# EAGLE design Candle-V01-005 (EAGLE 9.5.0)
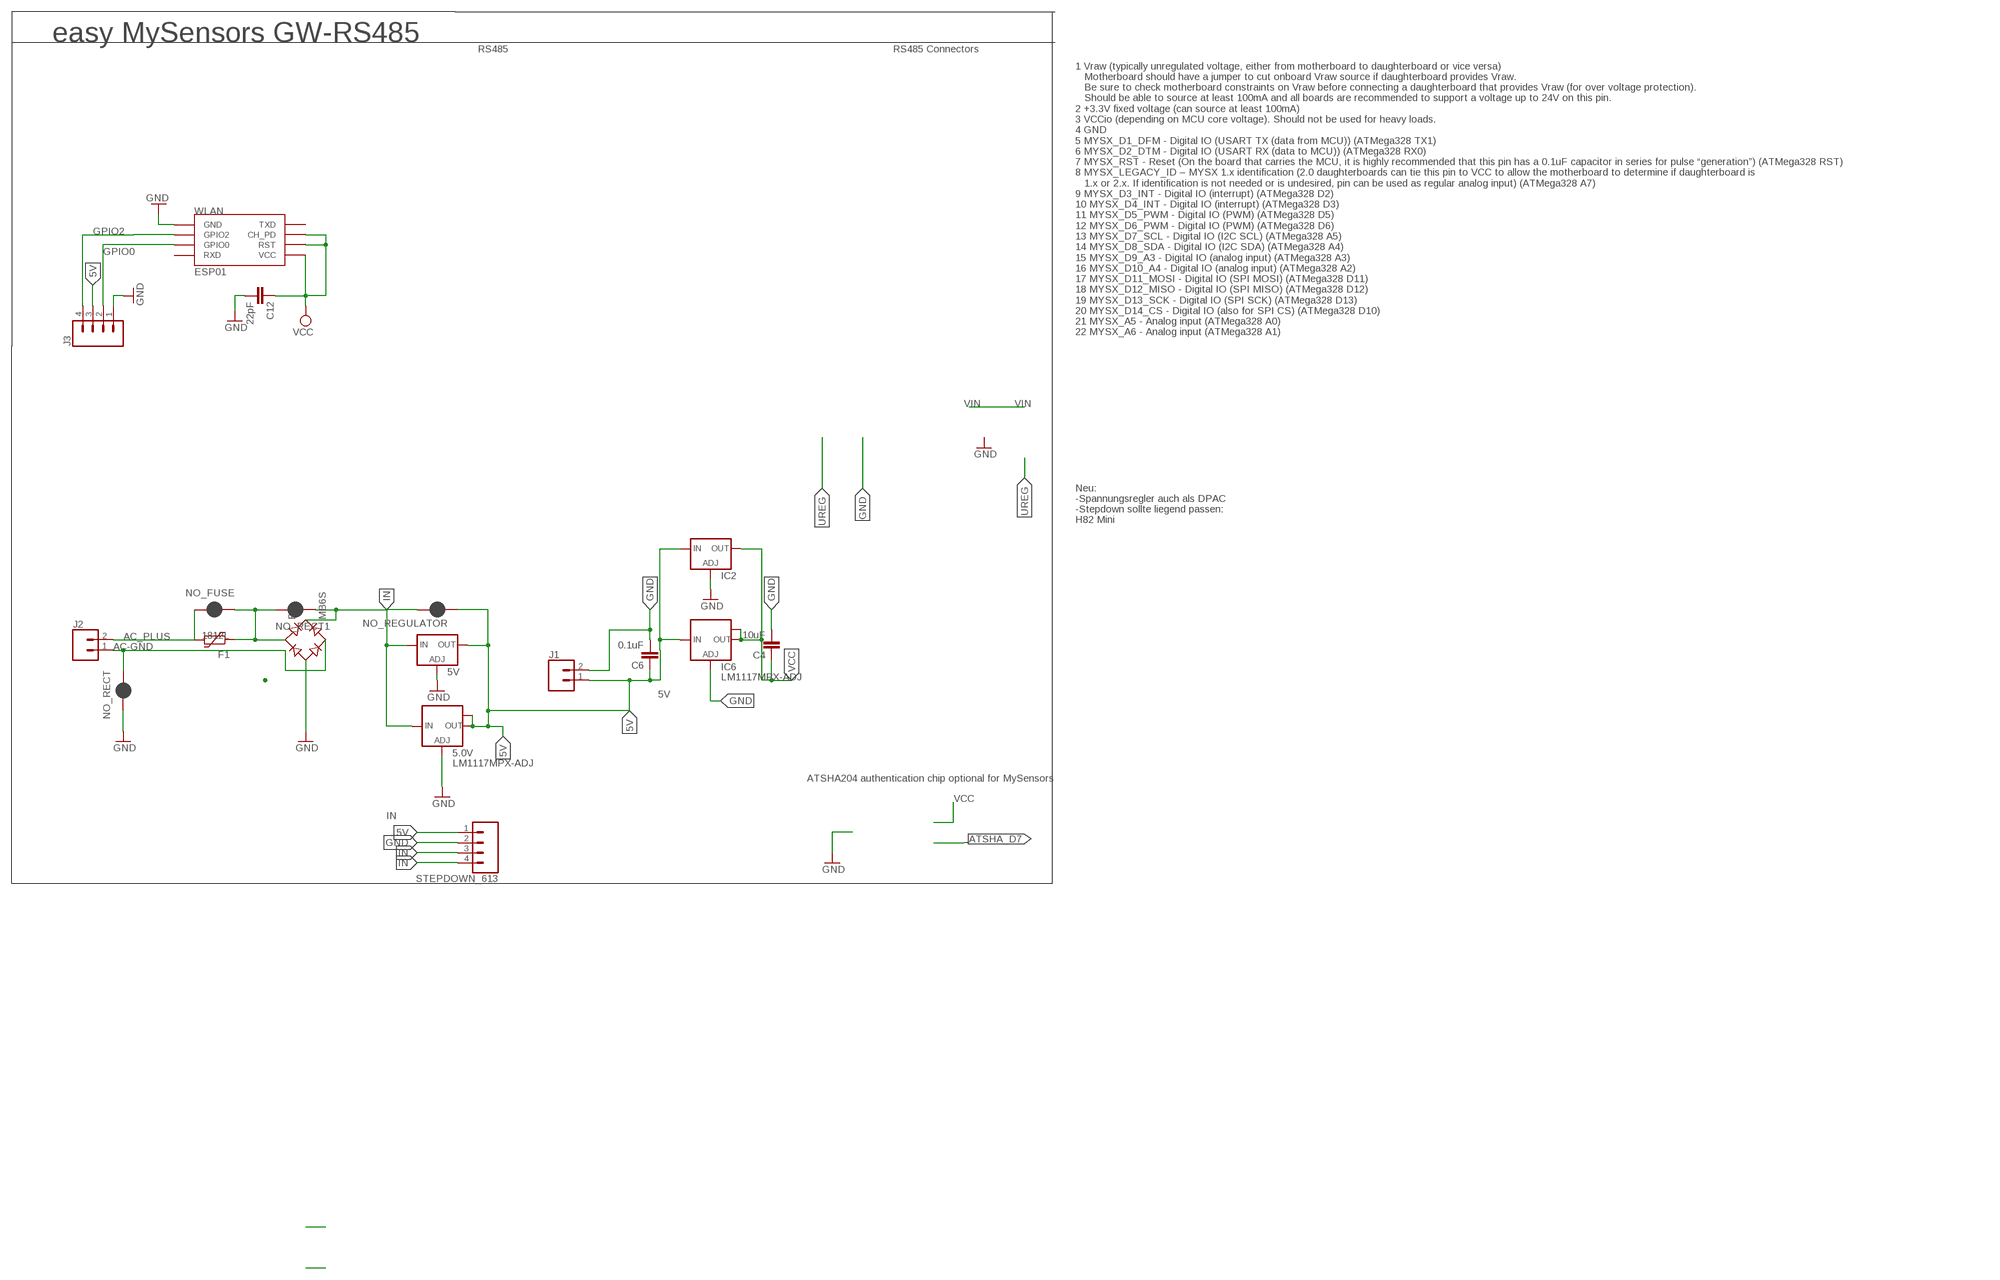
[diagram p0: schematic, sheet 1]

## Parts
5.0V  LM1117MPX-ADJ  [SOT223]
5V  LD117ADT50TR  [DPACK]
B1  MB6S  [SOIC-4]
C4  10uF  C-EUC1210  [C1210]
C6  0.1uF  C-EUC1206  [C1206]
C12  22pF  C-EUC0805  [C0805]
F1  1812L  [1812L]
IC2  LD117ADT50TR  [DPACK]
IC6  LM1117MPX-ADJ  [SOT223]
J1  CONN_02PTH3  [1X02_LONGPADS]
J2  CONN_02PTH3  [1X02_LONGPADS]
J3  CONN_04LONGPADS  [1X04_LONGPADS]
NO_FUSE  JUMPER-SMT_2_NC_PASTE_NO-SILK  [SMT-JUMPER_2_NC_PASTE_NO-SILK]
NO_RECT  JUMPER-SMT_2_NC_PASTE_NO-SILK  [SMT-JUMPER_2_NC_PASTE_NO-SILK]
NO_RECT1  JUMPER-SMT_2_NC_PASTE_NO-SILK  [SMT-JUMPER_2_NC_PASTE_NO-SILK]
NO_REGULATOR  JUMPER-SMT_2_NC_PASTE_NO-SILK  [SMT-JUMPER_2_NC_PASTE_NO-SILK]
STEPDOWN_613  CONN_04  [1X04]
WLAN  ESP01  [ESP01]

## Nets
5V [Power]: 5.0V.2(OUT) 5.0V.TAB(OUT1) 5V.4(OUT) C6.1 IC2.3(IN) IC6.3(IN) J1.1 J3.3 NO_REGULATOR.1 STEPDOWN_613.1
AC-GND [Power]: B1.~2(AC2) J2.1 NO_RECT.1
AC_PLUS [Power]: F1.P$2 J2.2 NO_FUSE.2
GND [Power]: 5.0V.1(ADJ) 5V.1(ADJ) B1.- C4.2 C6.2 C12.2 IC2.1(ADJ) IC6.1(ADJ) J1.2 J3.1 NO_RECT.2 STEPDOWN_613.2 WLAN.GND
GPIO0: J3.2 WLAN.GPIO0
GPIO2: J3.4 WLAN.GPIO2
IN [Power]: 5.0V.3(IN) 5V.3(IN) B1.+ NO_RECT1.2 NO_REGULATOR.2 STEPDOWN_613.3 STEPDOWN_613.4
N$5 [Power]: B1.~1(AC1) F1.P$1 NO_FUSE.1 NO_RECT1.1
VCC [Power]: C4.1 C12.1 IC2.4(OUT) IC6.2(OUT) IC6.TAB(OUT1) WLAN.CH_PD WLAN.RST WLAN.VCC
Unconnected: WLAN.RX(RXD) WLAN.TX(TXD)

## Notes on the sheet
- easy MySensors GW-RS485
- RS485 | RS485 Connectors
- 1 Vraw (typically unregulated voltage, either from motherboard to daughterboard or vice versa)
     Motherboard should have a jumper to cut onboard Vraw source if daughterboard provides Vraw. 
     Be sure to check motherboard constraints on Vraw before connecting a daughterboard that provides Vraw (for over voltage protection). 
     Should be able to source at least 100mA and all boards are recommended to support a voltage up to 24V on this pin.
  2 +3.3V fixed voltage (can source at least 100mA)
  3 VCCio (depending on MCU core voltage). Should not be used for heavy loads.
  4 GND
  5 MYSX_D1_DFM - Digital IO (USART TX (data from MCU)) (ATMega328 TX1)
  6 MYSX_D2_DTM - Digital IO (USART RX (data to MCU)) (ATMega328 RX0)
  7 MYSX_RST - Reset (On the board that carries the MCU, it is highly recommended that this pin has a 0.1uF capacitor in series for pulse “generation”) (ATMega328 RST)
  8 MYSX_LEGACY_ID – MYSX 1.x identification (2.0 daughterboards can tie this pin to VCC to allow the motherboard to determine if daughterboard is 
     1.x or 2.x. If identification is not needed or is undesired, pin can be used as regular analog input) (ATMega328 A7)
  9 MYSX_D3_INT - Digital IO (interrupt) (ATMega328 D2)
  10 MYSX_D4_INT - Digital IO (interrupt) (ATMega328 D3)
  11 MYSX_D5_PWM - Digital IO (PWM) (ATMega328 D5)
  12 MYSX_D6_PWM - Digital IO (PWM) (ATMega328 D6)
  13 MYSX_D7_SCL - Digital IO (I2C SCL) (ATMega328 A5)
  14 MYSX_D8_SDA - Digital IO (I2C SDA) (ATMega328 A4)
  15 MYSX_D9_A3 - Digital IO (analog input) (ATMega328 A3)
  16 MYSX_D10_A4 - Digital IO (analog input) (ATMega328 A2)
  17 MYSX_D11_MOSI - Digital IO (SPI MOSI) (ATMega328 D11)
  18 MYSX_D12_MISO - Digital IO (SPI MISO) (ATMega328 D12)
  19 MYSX_D13_SCK - Digital IO (SPI SCK) (ATMega328 D13)
  20 MYSX_D14_CS - Digital IO (also for SPI CS) (ATMega328 D10)
  21 MYSX_A5 - Analog input (ATMega328 A0)
  22 MYSX_A6 - Analog input (ATMega328 A1)
- Neu:
  -Spannungsregler auch als DPAC
  -Stepdown sollte liegend passen:  
  H82 Mini
- ATSHA204 authentication chip optional for MySensors

## Library data of the parts
5.0V IC6 = lm1117:LM1117MPX-ADJ
5V IC2 = v-reg:LD117A?*: Low drop fixed and adjustable positive voltage regulators 1 A Source: http://www.st.com/stonline/products/literature/ds/7194/ld1117axx.pdf
B1 = rectifier:MB*S: Bridge Rectifier Source: http://www.fairchildsemi.com/ds/MB/MB6S.pdf
C4 C6 C12 = rcl:C-EU: CAPACITOR, European symbol; SPICEPREFIX: C
F1 = ptc-littlefuse:1812L
J1 J2 = SparkFun-Connectors:CONN_02: Multi connection point. Often used as Generic Header-pin footprint for 0.1 inch spaced/style header connections On any of the 0.1 inch spaced packages, you can populate with these: Break Away Headers - Straight <https://www.sparkfun.com/products/116> (PRT-00116) Break Away Male Headers - Right Angle <https://www.sparkfun.com/products/553> (PRT-00553) Female Headers <https://www.sparkfun.com/products/115> (PRT-00115) Break Away Headers - Machine Pin <https://www.sparkfun.com/products/117> (PRT-00117) Break Away Female Headers - Swiss Machine Pin <https://www.sparkfun.com/products/743> (PRT-00743) For SCREWTERMINALS and SPRING TERMINALS visit here: Screw Terimnals on SparkFun.com <https://www.sparkfun.com/search/results?term=Screw+Terminals> (5mm/3.5mm/2.54mm spacing) This device is also useful as a general connection point to wire up your design to another part of your project. Our various solder wires solder well into these plated through hole pads. Hook-Up Wire - Assortment (Stranded, 22 AWG) <https://www.sparkfun.com/products/11375> (PRT-11375) Hook-Up Wire - Assortment (Solid Core, 22 AWG) <https://www.sparkfun.com/products/11367> (PRT-11367) View the entire wire category on our website here <https://www.sparkfun.com/categories/141> Special notes: Molex polarized connector foot print use with: PRT-08233 with associated crimp pins and housings. 2.54_SCREWTERM for use with PRT-10571. 3.5mm Screw Terminal footprints for PRT-08084 5mm Screw Terminal footprints for use with PRT-08432
J3 STEPDOWN_613 = SparkFun-Connectors:CONN_04: Multi connection point. Often used as Generic Header-pin footprint for 0.1 inch spaced/style header connections On any of the 0.1 inch spaced packages, you can populate with these: Break Away Headers - Straight <https://www.sparkfun.com/products/116> (PRT-00116) Break Away Male Headers - Right Angle <https://www.sparkfun.com/products/553> (PRT-00553) Female Headers <https://www.sparkfun.com/products/115> (PRT-00115) Break Away Headers - Machine Pin <https://www.sparkfun.com/products/117> (PRT-00117) Break Away Female Headers - Swiss Machine Pin <https://www.sparkfun.com/products/743> (PRT-00743) For SCREWTERMINALS and SPRING TERMINALS visit here: Screw Terimnals on SparkFun.com <https://www.sparkfun.com/search/results?term=Screw+Terminals> (5mm/3.5mm/2.54mm spacing) This device is also useful as a general connection point to wire up your design to another part of your project. Our various solder wires solder well into these plated through hole pads. Hook-Up Wire - Assortment (Stranded, 22 AWG) <https://www.sparkfun.com/products/11375> (PRT-11375) Hook-Up Wire - Assortment (Solid Core, 22 AWG) <https://www.sparkfun.com/products/11367> (PRT-11367) View the entire wire category on our website here <https://www.sparkfun.com/categories/141> Special notes: Molex polarized connector foot print use with SKU : PRT-08231 with associated crimp pins and housings. 1MM SMD Version SKU: PRT-10208; PROD_ID: CONN-09696
NO_FUSE NO_RECT NO_RECT1 NO_REGULATOR = SparkFun-Jumpers:JUMPER-SMT_2_NC_PASTE: Normally closed solder jumper This jumper has an aperture in the stencil to allow solder paste to bridge the split in the wire so it's normally closed (NC). Wick off the solder to open the connection. Reapply solder to reclose the connection.
WLAN = esp8266modules:ESP01: ESP8266 Wifi module 01

## Net classes
0 default: width 0.305 mm
1 Power: width 0.635 mm

## Board
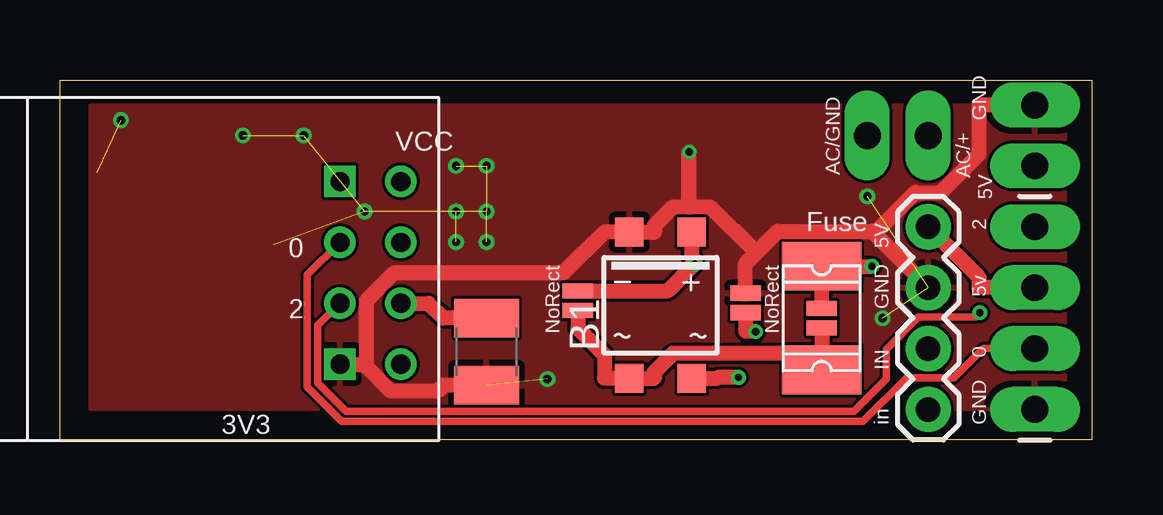
[diagram p1: board, top side]
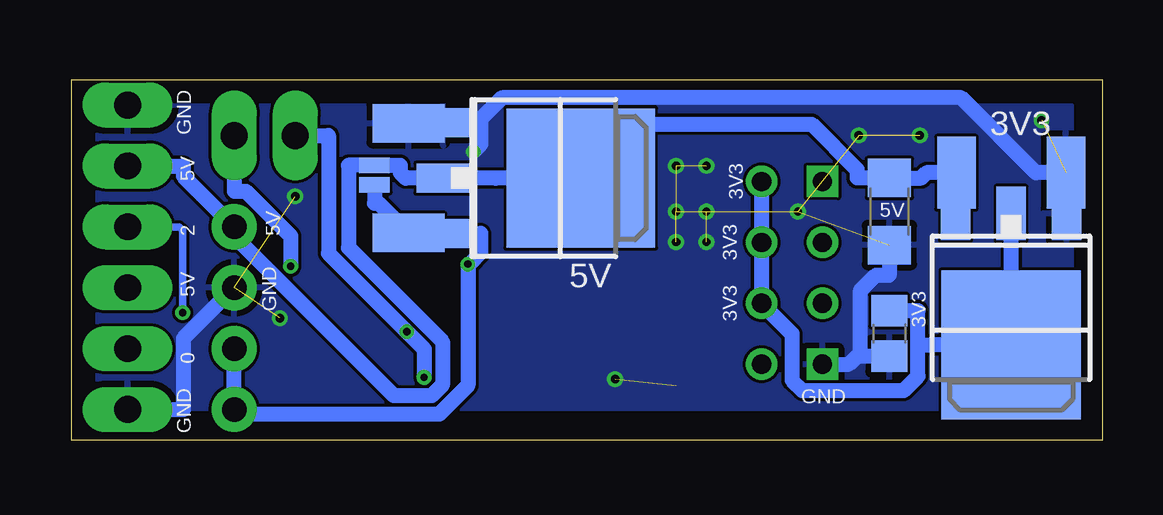
[diagram p2: board, bottom side, seen from below]

Size 43 x 15 mm. Coordinates in mm from the lower left corner, seen from the top.
Outline: 0,0 0,15 43,15 43,0 0,0
Copper layers (1*16): Top 0.035mm / dielectric 1.5mm / Bottom 0.035mm
Design rules "dirt_cheap_dirty_boards.v1": minimum track width 5mil, minimum drill 12mil, track to track 5mil, track to pad 5mil, pad to pad 5mil, via to via 5mil, smd to smd 0mil, copper to edge 10mil, drill to drill 10mil, minimum pad ring 10mil, minimum via ring 6mil, stop-mask expansion 2mil, vias tented up to drill 25mil, thermal gap 10mil

### Footprints (pad centres in the part's own frame; a part is rotated, then mirrored left to right if it is on the bottom)
SOT223 = smd 1.219 x 2.235: 1 -2.311,-3.099; 2 0,-3.099; 3 2.311,-3.099 | smd 3.6 x 2.2: TAB 0,3.099
DPACK = smd 1.6 x 3: 1 -2.28,-4.8; 3 2.28,-4.8 | smd 5.8 x 6.2: 4 0,2.38
SOIC-4 = smd 1.2 x 1.2: + 1.3,3.05; - -1.3,3.05; ~1 -1.3,-3.05; ~2 1.3,-3.05
C1210 = smd 1.6 x 2.7: 1 -1.4,0; 2 1.4,0
C1206 = smd 1.6 x 1.8: 1 -1.4,0; 2 1.4,0
C0805 = smd 1.3 x 1.5: 1 -0.95,0; 2 0.95,0
1812L = smd 2.03 x 3.3: P$1 -2.16,0; P$2 2.16,0
1X02_LONGPADS = drill 1.118 pad 1.88 long: 1 0,0; 2 2.54,0
1X04_LONGPADS = drill 1.118 pad 1.88 long: 1 0,0; 2 2.54,0; 3 5.08,0; 4 7.62,0
SMT-JUMPER_2_NC_PASTE_NO-SILK = smd 0.635 x 1.27: 1 -0.406,0; 2 0.406,0
1X04 = drill 1.016 pad 1.88: 1 0,0; 2 2.54,0; 3 5.08,0; 4 7.62,0
ESP01 = drill 0.8: CH_PD -1.285,-8.178; GPIO0 1.255,-5.638; GPIO2 -1.285,-5.638; RST 1.255,-8.178; TX -3.825,-8.178; VCC 3.795,-8.178 | drill 0.8 square: GND -3.825,-5.638; RX 3.795,-5.638

### Placement (x,y rotation side)
5.0V  24.38,10.92 270 bottom
5V  24.13,10.92 270 bottom
B1  25.03,5.62 0 top
C4  17.78,3.68 270 top
C6  8.89,9.53 270 bottom
C12  8.89,4.45 270 bottom
F1  31.75,5.08 90 top
IC2  3.81,6.35 180 bottom
IC6  3.81,6.35 180 bottom
J1  40.64,11.43 90 top
J2  33.66,12.7 0 top
J3  40.64,1.27 90 top
NO_FUSE  31.75,5.08 90 top
NO_RECT  28.57,5.71 90 top
NO_RECT1  21.59,5.81 90 top
NO_REGULATOR  30.35,11.05 270 bottom
STEPDOWN_613  36.2,8.89 270 top
WLAN  6.04,6.99 90 top

### Tracks (layer width: path | path; a pad name or v marks a point on that pad's centre or on a via)
5V
  Top 0.635: J3.3 38.32,6.35 38.32,6.77 STEPDOWN_613.1
  Bottom 0.635: IC6.3 6.12,11.01 6.09,11.04 IC2.3 7.33,11.15 7.54,10.94 7.54,10.93 C6.1 9.56,10.93 10.23,10.93 10.23,11.29 12.12,13.17 21.29,13.17 5.0V.TAB 5V.4 25.3,10.92 5.0V.2 29.05,10.92 29.27,11.15 29.27,11.46 NO_REGULATOR.1 30.89,11.46 31.43,11.46 31.43,8.02 27.52,4.11 27.52,2.29 27.97,1.84 29.53,1.84 36.2,8.5 STEPDOWN_613.1 38.32,11.01 38.32,11.43 J1.1
AC-GND  (via drill 0.3 pad 0.61)
  Top 0.635: B1.~2 27.38,2.57 27.42,2.61 v28.28,2.61 | NO_RECT.1 28.57,4.55 28.96,4.55 v29,4.51
  Bottom 0.635: v28.28,2.61 28.28,3.79 v29,4.51 32.27,7.78 32.27,12.7 J2.1
AC_PLUS  (via drill 0.3 pad 0.61)
  Top 0.635: v33.84,7.24 F1.P$2 NO_FUSE.2
  Bottom 0.635: J2.2 36.2,10.38 35.72,10.38 33.84,8.5 v33.84,7.24 | v33.84,7.24
GND  (via drill 0.3 pad 0.61, 0.35)  (13 unrouted)
  Top 0.635: 26.22,9.71 25.55,9.71 24.78,8.95 24.78,8.67 B1.- 22.69,8.67 21,6.98 13.94,6.98 12.77,5.81 12.77,3.16 | 29.02,7.81 27.12,9.71 26.22,9.71 | 26.22,9.71 v26.22,12.02 | 29.02,7.81 29.92,8.7 33.84,8.7 33.94,8.6 | NO_RECT.2 28.57,7.36 29.02,7.81 | 12.77,3.16 12.58,3.16 WLAN.GND | 12.77,3.16 12.77,3.05 13.76,2.06 15.76,2.06 15.98,2.28 C4.2 | 33.94,8.6 STEPDOWN_613.2 | 33.94,8.6 35.67,10.32 36.72,10.32 38.32,11.92 38.32,13.97 J1.2
  Bottom 0.635: 25.92,13.23 25.92,13.39 25.04,14.27 5.89,14.27 2.77,11.15 IC2.1 1.53,11.04 1.5,11.01 IC6.1 | 25.92,13.23 5.0V.1 28.9,13.23 5V.1 | 25.92,13.23 25.92,12.32 v26.22,12.02 | WLAN.GND 10.57,3.16 10.24,3.5 10.09,3.5 | C6.2 8.89,6.88 9.44,6.88 10.09,6.24 10.09,3.5 | 10.09,3.5 9.97,3.5 C12.2 | STEPDOWN_613.2 38.32,4.23 38.32,1.27 J3.1
  other vias: 16.51,11.43 10.16,12.7 7.62,12.7 2.54,13.34 16.51,9.53 17.78,11.43 17.78,9.53 17.78,8.26 16.51,8.26 20.32,2.54 34.29,5.08 33.66,10.16 12.7,9.53
  pour Top: 1.27,1.27 41.91,1.27 41.91,13.97 1.27,13.97
  pour Bottom: 1.27,1.27 1.27,13.97 41.91,13.97 41.91,1.27
GPIO0
  Top 0.305: J3.2 38.48,3.81 37.26,2.59 35.3,2.59 33.48,0.77 11.74,0.77 10.3,2.21 10.3,6.87 WLAN.GPIO0
GPIO2  (via drill 0.3 pad 0.61)
  Top 0.305: WLAN.GPIO2 10.74,4.77 10.74,2.39 11.92,1.2 33.09,1.2 34.44,2.55 34.44,3.79 35.79,5.13 38.16,5.13 v38.34,5.31
  Bottom 0.305: J3.4 38.48,8.89 38.34,8.75 v38.34,5.31
IN  (via drill 0.3 pad 0.61)
  Top 0.635: NO_RECT1.2 25.34,6.22 v26.45,7.34 26.45,7.5 26.33,7.62 B1.+
  Bottom 0.635: STEPDOWN_613.3 STEPDOWN_613.4 36,1.08 27.66,1.08 26.45,2.28 v26.45,7.34 26.4,7.34 25.92,7.81 25.92,8.61 5.0V.3 29.05,8.61 29.05,8.76 29.55,9.26 | 29.55,9.26 5V.3 | 29.55,9.26 30.17,9.88 30.35,9.88 NO_REGULATOR.2
N$5
  Top 0.635: 31.75,3.61 F1.P$1 | NO_FUSE.1 31.75,3.61 | 31.75,3.61 25.55,3.61 24.78,2.85 24.78,2.57 B1.~1 22.69,2.57 22.69,3.54 21.59,4.64 NO_RECT1.1
VCC
  Top 0.635: C4.1 15.98,5.08 15.37,5.7 WLAN.CH_PD
  Bottom 0.635: 7.7,3.97 7.7,5.39 C12.1 | 7.7,3.97 7.7,2.65 8.29,2.06 12.51,2.06 12.94,2.49 12.94,4.43 WLAN.CH_PD WLAN.RST WLAN.VCC | 7.7,3.97 7.16,3.97 IC2.4 | IC2.4 IC6.2 | IC6.TAB IC2.4

### Text on the board
bPlace: easyMySens-Gateway-Mini-RS485 V4.1
tNames: AC/+ | GND | VCC | AC/GND | Fuse | 5V | 2 | 0 | 5V | 5v | 2 | GND | NoRect | NoRect | IN | 0 | in | GND | 3V3
bNames: GND | 3V3 | 5V | 5V | 3V3 | 5V | 2 | 3V3 | GND | 5V | 5V | 3V3 | 3V3 | 0 | GND | GND